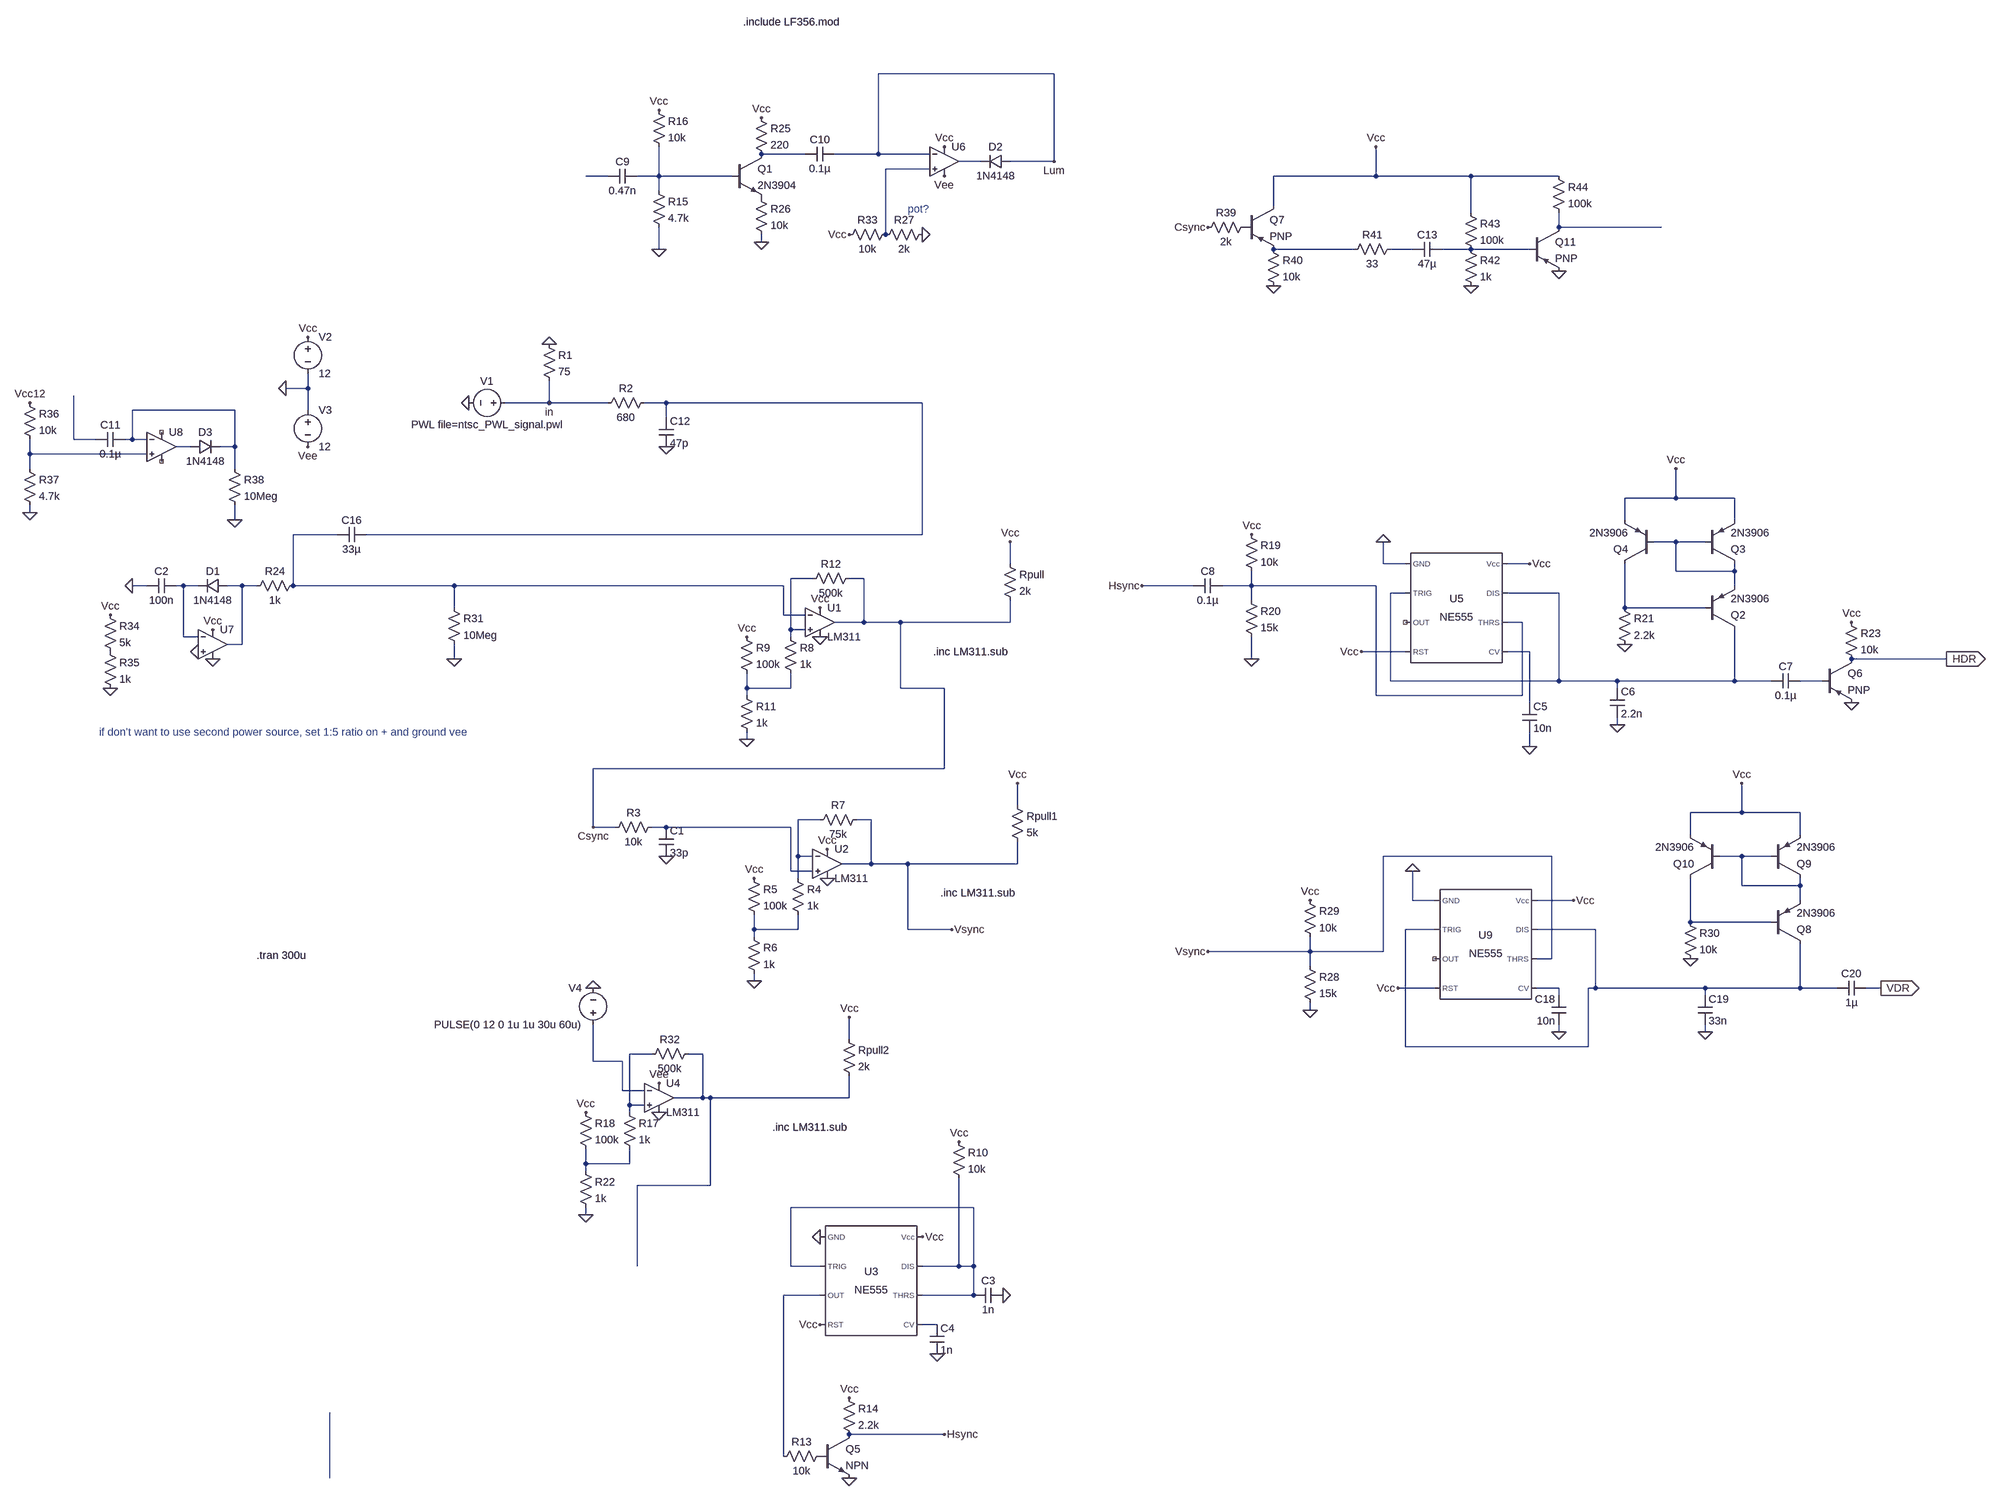
[diagram p0: schematic seventhIteration(postdemo).asc]
seventhIteration(postdemo).asc, the LTspice schematic file:
Version 4.1
SHEET 1 4812 2340
WIRE 1264 -912 880 -912
WIRE 720 -736 624 -736
WIRE 880 -736 880 -912
WIRE 880 -736 784 -736
WIRE 992 -736 880 -736
WIRE 1104 -720 1056 -720
WIRE 1264 -720 1264 -912
WIRE 1264 -720 1168 -720
WIRE 992 -704 896 -704
WIRE 288 -688 240 -688
WIRE 400 -688 400 -752
WIRE 400 -688 352 -688
WIRE 560 -688 400 -688
WIRE 1968 -688 1968 -752
WIRE 1968 -688 1744 -688
WIRE 2176 -688 1968 -688
WIRE 2368 -688 2176 -688
WIRE 400 -656 400 -688
WIRE 1744 -624 1744 -688
WIRE 2176 -608 2176 -688
WIRE 2368 -576 2368 -608
WIRE 2592 -576 2368 -576
WIRE 896 -560 896 -704
WIRE 624 -544 624 -560
WIRE 400 -528 400 -576
WIRE 1920 -528 1744 -528
WIRE 2048 -528 2000 -528
WIRE 2176 -528 2112 -528
WIRE 2304 -528 2176 -528
WIRE -368 -224 -368 -256
WIRE -368 -224 -416 -224
WIRE 160 -192 160 -240
WIRE 160 -192 64 -192
WIRE 288 -192 160 -192
WIRE 416 -192 368 -192
WIRE 976 -192 416 -192
WIRE -528 -176 -752 -176
WIRE -368 -176 -368 -224
WIRE 416 -160 416 -192
WIRE -880 -112 -880 -208
WIRE -832 -112 -880 -112
WIRE -752 -112 -752 -176
WIRE -752 -112 -768 -112
WIRE -720 -112 -752 -112
WIRE -624 -96 -656 -96
WIRE -528 -96 -528 -176
WIRE -528 -96 -560 -96
WIRE -976 -80 -976 -112
WIRE -720 -80 -976 -80
WIRE -976 -48 -976 -80
WIRE -528 -48 -528 -96
WIRE 2624 16 2624 -48
WIRE 2624 16 2512 16
WIRE 2752 16 2624 16
WIRE -976 48 -976 32
WIRE -528 64 -528 32
WIRE 2512 64 2512 16
WIRE 2752 64 2752 16
WIRE -304 96 -400 96
WIRE 976 96 976 -192
WIRE 976 96 -240 96
WIRE 2624 112 2576 112
WIRE 2688 112 2624 112
WIRE 1168 160 1168 112
WIRE 1984 160 1984 112
WIRE 2032 160 1984 160
WIRE 2304 160 2256 160
WIRE 2624 176 2624 112
WIRE 2752 176 2752 160
WIRE 2752 176 2624 176
WIRE 736 192 688 192
WIRE 848 192 816 192
WIRE -720 208 -752 208
WIRE -640 208 -656 208
WIRE -608 208 -640 208
WIRE -512 208 -544 208
WIRE -480 208 -512 208
WIRE -400 208 -400 96
WIRE -48 208 -400 208
WIRE 672 208 -48 208
WIRE 1568 208 1456 208
WIRE 1696 208 1696 176
WIRE 1696 208 1632 208
WIRE 1968 208 1696 208
WIRE 2752 208 2752 176
WIRE 2032 224 2000 224
WIRE 2368 224 2256 224
WIRE 1696 240 1696 208
WIRE -48 256 -48 208
WIRE 2512 256 2512 160
WIRE 2688 256 2512 256
WIRE 672 272 672 208
WIRE 720 272 672 272
WIRE 848 288 848 192
WIRE 848 288 784 288
WIRE 928 288 848 288
WIRE 1168 288 1168 240
WIRE 1168 288 928 288
WIRE 2288 288 2256 288
WIRE 688 304 688 192
WIRE 720 304 688 304
WIRE -640 320 -640 208
WIRE -608 320 -640 320
WIRE 688 320 688 304
WIRE -512 336 -512 208
WIRE -512 336 -544 336
WIRE 2032 352 1936 352
WIRE 2304 352 2256 352
WIRE -48 368 -48 336
WIRE 1696 368 1696 320
WIRE 3216 368 3008 368
WIRE 2000 416 2000 224
WIRE 2368 416 2368 224
WIRE 2368 416 2000 416
WIRE 2496 416 2368 416
WIRE 2752 416 2752 304
WIRE 2752 416 2496 416
WIRE 2832 416 2752 416
WIRE 2944 416 2896 416
WIRE 592 432 592 400
WIRE 688 432 688 400
WIRE 688 432 592 432
WIRE 928 432 928 288
WIRE 1024 432 928 432
WIRE 2496 432 2496 416
WIRE 592 448 592 432
WIRE 1968 448 1968 208
WIRE 2288 448 2288 288
WIRE 2288 448 1968 448
WIRE 2304 464 2304 352
WIRE 2496 512 2496 496
WIRE 592 544 592 528
WIRE 2304 560 2304 528
WIRE 1024 608 1024 432
WIRE 1024 608 256 608
WIRE 1184 688 1184 640
WIRE 2768 704 2768 640
WIRE 2768 704 2656 704
WIRE 2896 704 2768 704
WIRE 752 720 704 720
WIRE 864 720 832 720
WIRE 256 736 256 608
WIRE 304 736 256 736
WIRE 416 736 384 736
WIRE 688 736 416 736
WIRE 2656 752 2656 704
WIRE 2896 752 2896 704
WIRE 704 800 704 720
WIRE 736 800 704 800
WIRE 2352 800 1984 800
WIRE 2768 800 2720 800
WIRE 2832 800 2768 800
WIRE 864 816 864 720
WIRE 864 816 800 816
WIRE 944 816 864 816
WIRE 1184 816 1184 768
WIRE 1184 816 944 816
WIRE 688 832 688 736
WIRE 736 832 688 832
WIRE 704 848 704 800
WIRE 2768 864 2768 800
WIRE 2896 864 2896 848
WIRE 2896 864 2768 864
WIRE 2048 896 2048 832
WIRE 2096 896 2048 896
WIRE 2400 896 2320 896
WIRE 2896 896 2896 864
WIRE 2656 944 2656 848
WIRE 2832 944 2656 944
WIRE 608 960 608 928
WIRE 704 960 704 928
WIRE 704 960 608 960
WIRE 944 960 944 816
WIRE 1040 960 944 960
WIRE 2096 960 2032 960
WIRE 2448 960 2320 960
WIRE 608 976 608 960
WIRE 1824 1008 1824 976
WIRE 1824 1008 1600 1008
WIRE 1984 1008 1984 800
WIRE 1984 1008 1824 1008
WIRE 2352 1024 2352 800
WIRE 2352 1024 2320 1024
WIRE 1824 1040 1824 1008
WIRE 608 1072 608 1056
WIRE 2096 1088 2016 1088
WIRE 2368 1088 2320 1088
WIRE 2448 1088 2448 960
WIRE 2448 1088 2432 1088
WIRE 2688 1088 2448 1088
WIRE 2896 1088 2896 992
WIRE 2896 1088 2688 1088
WIRE 2976 1088 2896 1088
WIRE 3072 1088 3040 1088
WIRE 2368 1104 2368 1088
WIRE 2688 1104 2688 1088
WIRE 1824 1136 1824 1120
WIRE 2368 1184 2368 1168
WIRE 2688 1184 2688 1168
WIRE 816 1200 816 1152
WIRE 2032 1216 2032 960
WIRE 2432 1216 2432 1088
WIRE 2432 1216 2032 1216
WIRE 384 1232 336 1232
WIRE 496 1232 464 1232
WIRE 256 1248 256 1168
WIRE 320 1248 256 1248
WIRE 320 1312 320 1248
WIRE 368 1312 320 1312
WIRE 496 1328 496 1232
WIRE 496 1328 432 1328
WIRE 512 1328 496 1328
WIRE 816 1328 816 1280
WIRE 816 1328 512 1328
WIRE 336 1344 336 1232
WIRE 368 1344 336 1344
WIRE 336 1360 336 1344
WIRE 240 1472 240 1440
WIRE 336 1472 336 1440
WIRE 336 1472 240 1472
WIRE 240 1488 240 1472
WIRE 512 1520 512 1328
WIRE 512 1520 352 1520
WIRE 1088 1568 688 1568
WIRE 240 1584 240 1568
WIRE 352 1696 352 1520
WIRE 688 1696 688 1568
WIRE 752 1696 688 1696
WIRE 1056 1696 1056 1504
WIRE 1056 1696 976 1696
WIRE 1088 1696 1088 1568
WIRE 1088 1696 1056 1696
WIRE 752 1760 672 1760
WIRE 1088 1760 1088 1696
WIRE 1088 1760 976 1760
WIRE 1008 1824 976 1824
WIRE 1024 2064 816 2064
WIRE 672 2112 672 1760
WIRE -320 2160 -320 2016
FLAG -16 -192 0
FLAG 160 -320 0
FLAG 1696 96 Vcc
FLAG 1696 368 0
FLAG 1984 112 0
FLAG 2304 560 0
FLAG 2496 512 0
FLAG 2512 336 0
FLAG 3216 368 HDR
IOPIN 3216 368 Out
FLAG 1456 208 Hsync
FLAG 416 -96 0
FLAG 592 544 0
FLAG 752 256 Vcc
FLAG -368 -336 Vcc
FLAG -368 -96 Vee
FLAG -416 -224 0
FLAG 2304 160 Vcc
FLAG 2624 -48 Vcc
FLAG 1936 352 Vcc
FLAG 1168 112 Vcc
FLAG 592 320 Vcc
FLAG 752 320 0
FLAG -48 368 0
FLAG 416 800 0
FLAG -752 208 0
FLAG -576 304 Vcc
FLAG 608 1072 0
FLAG 768 784 Vcc
FLAG 1184 640 Vcc
FLAG 608 848 Vcc
FLAG 768 848 0
FLAG 1040 960 Vsync
FLAG 1824 1136 0
FLAG 1824 896 Vcc
FLAG 2400 896 Vcc
FLAG 2048 832 0
FLAG 2368 1184 0
FLAG 2016 1088 Vcc
FLAG 2656 1024 0
FLAG 2768 640 Vcc
FLAG 2688 1184 0
FLAG 3072 1088 VDR
IOPIN 3072 1088 Out
FLAG 1600 1008 Vsync
FLAG 240 1584 0
FLAG 400 1296 Vee
FLAG 816 1152 Vcc
FLAG 240 1360 Vcc
FLAG 400 1360 0
FLAG 256 736 Csync
FLAG 752 1632 0
FLAG 976 1632 Vcc
FLAG 752 1824 Vcc
FLAG 1152 1760 0
FLAG 1056 1424 Vcc
FLAG 1008 1888 0
FLAG 816 1984 Vcc
FLAG 816 2160 0
FLAG 1024 2064 Hsync
FLAG 3008 288 Vcc
FLAG 3008 464 0
FLAG 400 -528 0
FLAG 624 -816 Vcc
FLAG 624 -544 0
FLAG 400 -832 Vcc
FLAG 1024 -688 Vee
FLAG 1024 -752 Vcc
FLAG 816 -560 Vcc
FLAG 976 -560 0
FLAG 1264 -720 Lum
FLAG -800 432 0
FLAG -800 272 Vcc
FLAG -976 48 0
FLAG -976 -192 Vcc12
FLAG -528 64 0
FLAG -576 368 0
FLAG 256 1088 0
FLAG -608 352 0
FLAG 160 -192 in
FLAG 1744 -448 0
FLAG 2176 -448 0
FLAG 1968 -752 Vcc
FLAG 2368 -480 0
FLAG 1600 -576 Csync
DATAFLAG 592 432 ""
DATAFLAG 608 960 ""
DATAFLAG 240 1472 ""
SYMBOL voltage 80 -192 R90
WINDOW 0 -32 56 VBottom 2
WINDOW 3 32 56 VTop 2
WINDOW 123 0 0 Left 0
WINDOW 39 0 0 Left 0
SYMATTR InstName V1
SYMATTR Value PWL file=ntsc_PWL_signal.pwl
SYMBOL res 144 -336 R0
SYMATTR InstName R1
SYMATTR Value 75
SYMBOL Misc\\NE555 2144 256 R0
SYMATTR InstName U5
SYMBOL res 1680 80 R0
SYMATTR InstName R19
SYMATTR Value 10k
SYMBOL res 1680 224 R0
SYMATTR InstName R20
SYMATTR Value 15k
SYMBOL cap 2288 464 R0
SYMATTR InstName C5
SYMATTR Value 10n
SYMBOL cap 2480 432 R0
SYMATTR InstName C6
SYMATTR Value 2.2n
SYMBOL cap 2896 400 R90
WINDOW 0 0 32 VBottom 2
WINDOW 3 32 32 VTop 2
SYMATTR InstName C7
SYMATTR Value 0.1µ
SYMBOL pnp 2688 304 M180
SYMATTR InstName Q2
SYMATTR Value 2N3906
SYMBOL pnp 2688 160 M180
SYMATTR InstName Q3
SYMATTR Value 2N3906
SYMBOL pnp 2576 160 R180
SYMATTR InstName Q4
SYMATTR Value 2N3906
SYMBOL res 2496 240 R0
SYMATTR InstName R21
SYMATTR Value 2.2k
SYMBOL cap 1632 192 R90
WINDOW 0 0 32 VBottom 2
WINDOW 3 32 32 VTop 2
SYMATTR InstName C8
SYMATTR Value 0.1µ
SYMBOL res 384 -208 R90
WINDOW 0 0 56 VBottom 2
WINDOW 3 32 56 VTop 2
SYMATTR InstName R2
SYMATTR Value 680
SYMBOL cap 400 -160 R0
SYMATTR InstName C12
SYMATTR Value 47p
SYMBOL res 672 304 R0
SYMATTR InstName R8
SYMATTR Value 1k
SYMBOL res 576 304 R0
SYMATTR InstName R9
SYMATTR Value 100k
SYMBOL res 576 432 R0
SYMATTR InstName R11
SYMATTR Value 1k
SYMBOL res 832 176 R90
WINDOW 0 0 56 VBottom 2
WINDOW 3 32 56 VTop 2
SYMATTR InstName R12
SYMATTR Value 500k
SYMBOL res 1152 144 R0
SYMATTR InstName Rpull
SYMATTR Value 2k
SYMBOL voltage -368 -352 R0
SYMATTR InstName V2
SYMATTR Value 12
SYMBOL voltage -368 -192 R0
SYMATTR InstName V3
SYMATTR Value 12
SYMBOL OpAmps\\opamp2 752 224 R0
SYMATTR InstName U1
SYMATTR Value LM311
SYMBOL res -64 240 R0
SYMATTR InstName R31
SYMATTR Value 10Meg
SYMBOL res 400 720 R90
WINDOW 0 0 56 VBottom 2
WINDOW 3 32 56 VTop 2
SYMATTR InstName R3
SYMATTR Value 10k
SYMBOL cap 400 736 R0
SYMATTR InstName C1
SYMATTR Value 33p
SYMBOL res -384 192 R90
WINDOW 0 0 56 VBottom 2
WINDOW 3 32 56 VTop 2
SYMATTR InstName R24
SYMATTR Value 1k
SYMBOL diode -544 192 R90
WINDOW 0 0 32 VBottom 2
WINDOW 3 32 32 VTop 2
SYMATTR InstName D1
SYMATTR Value 1N4148
SYMBOL cap -656 192 R90
WINDOW 0 0 32 VBottom 2
WINDOW 3 32 32 VTop 2
SYMATTR InstName C2
SYMATTR Value 100n
SYMBOL OpAmps\\UniversalOpAmp2 -576 336 R0
SYMATTR InstName U7
SYMBOL cap -240 80 R90
WINDOW 0 0 32 VBottom 2
WINDOW 3 32 32 VTop 2
SYMATTR InstName C16
SYMATTR Value 33µ
SYMBOL res 688 832 R0
SYMATTR InstName R4
SYMATTR Value 1k
SYMBOL res 592 832 R0
SYMATTR InstName R5
SYMATTR Value 100k
SYMBOL res 592 960 R0
SYMATTR InstName R6
SYMATTR Value 1k
SYMBOL res 848 704 R90
WINDOW 0 0 56 VBottom 2
WINDOW 3 32 56 VTop 2
SYMATTR InstName R7
SYMATTR Value 75k
SYMBOL res 1168 672 R0
SYMATTR InstName Rpull1
SYMATTR Value 5k
SYMBOL OpAmps\\opamp2 768 752 R0
SYMATTR InstName U2
SYMATTR Value LM311
SYMBOL res 1808 1024 R0
SYMATTR InstName R28
SYMATTR Value 15k
SYMBOL res 1808 880 R0
SYMATTR InstName R29
SYMATTR Value 10k
SYMBOL Misc\\NE555 2208 992 R0
SYMATTR InstName U9
SYMBOL cap 2384 1168 R180
WINDOW 0 24 56 Left 2
WINDOW 3 24 8 Left 2
SYMATTR InstName C18
SYMATTR Value 10n
SYMBOL pnp 2832 992 M180
SYMATTR InstName Q8
SYMATTR Value 2N3906
SYMBOL pnp 2832 848 M180
SYMATTR InstName Q9
SYMATTR Value 2N3906
SYMBOL pnp 2720 848 R180
SYMATTR InstName Q10
SYMATTR Value 2N3906
SYMBOL res 2640 928 R0
SYMATTR InstName R30
SYMATTR Value 10k
SYMBOL cap 2672 1104 R0
SYMATTR InstName C19
SYMATTR Value 33n
SYMBOL cap 3040 1072 R90
WINDOW 0 0 32 VBottom 2
WINDOW 3 32 32 VTop 2
SYMATTR InstName C20
SYMATTR Value 1µ
SYMBOL res 320 1344 R0
SYMATTR InstName R17
SYMATTR Value 1k
SYMBOL res 224 1344 R0
SYMATTR InstName R18
SYMATTR Value 100k
SYMBOL res 224 1472 R0
SYMATTR InstName R22
SYMATTR Value 1k
SYMBOL res 480 1216 R90
WINDOW 0 0 56 VBottom 2
WINDOW 3 32 56 VTop 2
SYMATTR InstName R32
SYMATTR Value 500k
SYMBOL res 800 1184 R0
SYMATTR InstName Rpull2
SYMATTR Value 2k
SYMBOL OpAmps\\opamp2 400 1264 R0
SYMATTR InstName U4
SYMATTR Value LM311
SYMBOL Misc\\NE555 864 1728 R0
SYMATTR InstName U3
SYMBOL cap 1152 1744 R90
WINDOW 0 0 32 VBottom 2
WINDOW 3 32 32 VTop 2
SYMATTR InstName C3
SYMATTR Value 1n
SYMBOL res 1040 1408 R0
SYMATTR InstName R10
SYMATTR Value 10k
SYMBOL cap 992 1824 R0
SYMATTR InstName C4
SYMATTR Value 1n
SYMBOL res 768 2096 R90
WINDOW 0 0 56 VBottom 2
WINDOW 3 32 56 VTop 2
SYMATTR InstName R13
SYMATTR Value 10k
SYMBOL npn 752 2064 R0
SYMATTR InstName Q5
SYMBOL res 800 1968 R0
SYMATTR InstName R14
SYMATTR Value 2.2k
SYMBOL res 2992 272 R0
SYMATTR InstName R23
SYMATTR Value 10k
SYMBOL pnp 2944 368 R0
SYMATTR InstName Q6
SYMBOL cap 352 -704 R90
WINDOW 0 0 32 VBottom 2
WINDOW 3 32 32 VTop 2
SYMATTR InstName C9
SYMATTR Value 0.47n
SYMBOL res 384 -672 R0
SYMATTR InstName R15
SYMATTR Value 4.7k
SYMBOL res 384 -848 R0
SYMATTR InstName R16
SYMATTR Value 10k
SYMBOL npn 560 -736 R0
SYMATTR InstName Q1
SYMATTR Value 2N3904
SYMBOL res 608 -832 R0
SYMATTR InstName R25
SYMATTR Value 220
SYMBOL cap 784 -752 R90
WINDOW 0 0 32 VBottom 2
WINDOW 3 32 32 VTop 2
SYMATTR InstName C10
SYMATTR Value 0.1µ
SYMBOL res 608 -656 R0
SYMATTR InstName R26
SYMATTR Value 10k
SYMBOL diode 1168 -736 R90
WINDOW 0 0 32 VBottom 2
WINDOW 3 32 32 VTop 2
SYMATTR InstName D2
SYMATTR Value 1N4148
SYMBOL res 992 -576 R90
WINDOW 0 0 56 VBottom 2
WINDOW 3 32 56 VTop 2
SYMATTR InstName R27
SYMATTR Value 2k
SYMBOL res 912 -576 R90
WINDOW 0 0 56 VBottom 2
WINDOW 3 32 56 VTop 2
SYMATTR InstName R33
SYMATTR Value 10k
SYMBOL res -816 256 R0
SYMATTR InstName R34
SYMATTR Value 5k
SYMBOL res -816 336 R0
SYMATTR InstName R35
SYMATTR Value 1k
SYMBOL OpAmps\\UniversalOpAmp2 1024 -720 R0
SYMATTR InstName U6
SYMATTR Value2 Avol=3500 GBW=300Meg Slew=1400Meg
SYMATTR SpiceLine Ilimit=60m Rail=0 Vos=0
SYMBOL cap -768 -128 R90
WINDOW 0 0 32 VBottom 2
WINDOW 3 32 32 VTop 2
SYMATTR InstName C11
SYMATTR Value 0.1µ
SYMBOL OpAmps\\UniversalOpAmp2 -688 -96 R0
SYMATTR InstName U8
SYMBOL res -992 -208 R0
SYMATTR InstName R36
SYMATTR Value 10k
SYMBOL res -992 -64 R0
SYMATTR InstName R37
SYMATTR Value 4.7k
SYMBOL diode -624 -80 R270
WINDOW 0 32 32 VTop 2
WINDOW 3 0 32 VBottom 2
SYMATTR InstName D3
SYMATTR Value 1N4148
SYMBOL res -544 -64 R0
SYMATTR InstName R38
SYMATTR Value 10Meg
SYMBOL voltage 256 1184 R180
WINDOW 0 24 96 Left 2
WINDOW 3 24 16 Left 2
WINDOW 123 0 0 Left 0
WINDOW 39 0 0 Left 0
SYMATTR InstName V4
SYMATTR Value PULSE(0 12 0 1u 1u 30u 60u)
SYMBOL res 1696 -592 R90
WINDOW 0 0 56 VBottom 2
WINDOW 3 32 56 VTop 2
SYMATTR InstName R39
SYMATTR Value 2k
SYMBOL pnp 1680 -624 R0
SYMATTR InstName Q7
SYMBOL res 1728 -544 R0
SYMATTR InstName R40
SYMATTR Value 10k
SYMBOL res 2016 -544 R90
WINDOW 0 0 56 VBottom 2
WINDOW 3 32 56 VTop 2
SYMATTR InstName R41
SYMATTR Value 33
SYMBOL cap 2112 -544 R90
WINDOW 0 0 32 VBottom 2
WINDOW 3 32 32 VTop 2
SYMATTR InstName C13
SYMATTR Value 47µ
SYMBOL res 2160 -544 R0
SYMATTR InstName R42
SYMATTR Value 1k
SYMBOL res 2160 -624 R0
SYMATTR InstName R43
SYMATTR Value 100k
SYMBOL pnp 2304 -576 R0
SYMATTR InstName Q11
SYMBOL res 2352 -704 R0
SYMATTR InstName R44
SYMATTR Value 100k
TEXT -480 1016 Left 2 !.tran 300u
TEXT 1000 352 Left 2 !.inc LM311.sub
TEXT 1016 880 Left 2 !.inc LM311.sub
TEXT 648 1392 Left 2 !.inc LM311.sub
TEXT 944 -616 Left 2 ;pot?
TEXT 584 -1104 Left 2 !.include LF356.mod
TEXT -824 528 Left 2 ;if don't want to use second power source, set 1:5 ratio on + and ground vee

The netlist it stands for:
* seventhIteration(postdemo).asc
V1 in 0 PWL file=ntsc_PWL_signal.pwl
R1 0 in 75
X§U5 0 N021 NC_01 Vcc N023 N020 N021 Vcc NE555  ; pins GND TRIG OUT RST CV THRS DIS Vcc
R19 Vcc N020 10k
R20 N020 0 15k
C5 N023 0 10n
C6 N021 0 2.2n
C7 N024 N021 0.1µ
Q2 N021 N022 N016 0 2N3906
Q3 N016 N016 Vcc 0 2N3906
Q4 N022 N016 Vcc 0 2N3906
R21 N022 0 2.2k
C8 N020 Hsync 0.1µ
R2 N010 in 680
C12 N010 0 47p
R8 N017 N025 1k
R9 Vcc N025 100k
R11 N025 0 1k
R12 Csync N017 500k
Rpull Vcc Csync 2k
V2 Vcc 0 12
V3 0 Vee 12
X§U1 N017 N015 Vcc 0 Csync LM311  ; pins In+ In- V+ V- OUT
R31 N015 0 10Meg
R3 N027 Csync 10k
C1 N027 0 33p
R24 N015 N019 1k
D1 N019 N018 1N4148
C2 N018 0 100n
X§U7 0 N018 Vcc 0 N019 level2 Avol=1Meg GBW=10Meg Slew=10Meg Ilimit=25m Rail=0 Vos=0 En=0 Enk=0 In=0 Ink=0 Rin=500Meg  ; pins In+ In- V+ V- OUT
C16 N010 N015 33µ
R4 N026 N030 1k
R5 Vcc N030 100k
R6 N030 0 1k
R7 Vsync N026 75k
Rpull1 Vcc Vsync 5k
X§U2 N027 N026 Vcc 0 Vsync LM311  ; pins In+ In- V+ V- OUT
R28 Vsync 0 15k
R29 Vcc Vsync 10k
X§U9 0 N031 NC_02 Vcc N032 Vsync N031 Vcc NE555  ; pins GND TRIG OUT RST CV THRS DIS Vcc
C18 0 N032 10n
Q8 N031 N029 N028 0 2N3906
Q9 N028 N028 Vcc 0 2N3906
Q10 N029 N028 Vcc 0 2N3906
R30 N029 0 10k
C19 N031 0 33n
C20 VDR N031 1µ
R17 N033 N036 1k
R18 Vcc N036 100k
R22 N036 0 1k
R32 N034 N033 500k
Rpull2 Vcc N034 2k
X§U4 N033 N035 Vee 0 N034 LM311  ; pins In+ In- V+ V- OUT
X§U3 0 N037 N038 Vcc N039 N037 N037 Vcc NE555  ; pins GND TRIG OUT RST CV THRS DIS Vcc
C3 0 N037 1n
R10 Vcc N037 10k
C4 N039 0 1n
R13 P001 N038 10k
Q5 Hsync P001 0 0 NPN
R14 Vcc Hsync 2.2k
R23 Vcc HDR 10k
Q6 HDR N024 0 0 PNP
C9 N005 N004 0.47n
R15 N005 0 4.7k
R16 Vcc N005 10k
Q1 N001 N005 P002 0 2N3904
R25 Vcc N001 220
C10 Lum N001 0.1µ
R26 P002 0 10k
D2 Lum N002 1N4148
R27 0 N003 2k
R33 N003 Vcc 10k
R34 Vcc P003 5k
R35 P003 0 1k
X§U6 N003 Lum Vcc Vee N002 level2 Avol=3500 GBW=300Meg Slew=1400Meg Ilimit=60m Rail=0 Vos=0 En=0 Enk=0 In=0 Ink=0 Rin=500Meg  ; pins In+ In- V+ V- OUT
C11 N011 N012 0.1µ
X§U8 N014 N011 NC_03 NC_04 N013 level2 Avol=1Meg GBW=10Meg Slew=10Meg Ilimit=25m Rail=0 Vos=0 En=0 Enk=0 In=0 Ink=0 Rin=500Meg  ; pins In+ In- V+ V- OUT
R36 Vcc12 N014 10k
R37 N014 0 4.7k
D3 N013 N011 1N4148
R38 N011 0 10Meg
V4 N035 0 PULSE(0 12 0 1u 1u 30u 60u)
R39 P004 Csync 2k
Q7 Vcc P004 N007 0 PNP
R40 N007 0 10k
R41 N008 N007 33
C13 N009 N008 47µ
R42 N009 0 1k
R43 Vcc N009 100k
Q11 N006 N009 0 0 PNP
R44 Vcc N006 100k
.model D D
.lib standard.dio
.model NPN NPN
.model PNP PNP
.lib standard.bjt
.tran 300u
.inc LM311.sub
.inc LM311.sub
.inc LM311.sub
* pot?
.include LF356.mod
* if don't want to use second power source, set 1:5 ratio on + and ground vee
.lib NE555.sub
.lib UniversalOpAmp2.lib
.backanno
.end